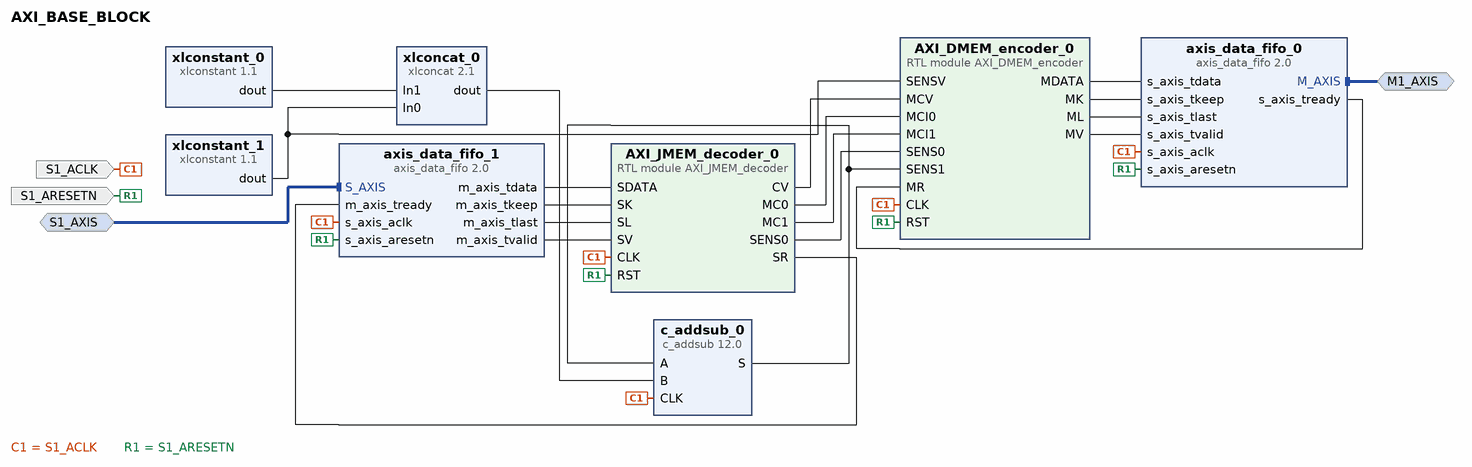
[diagram p0: block diagram of the top level]
# Vivado block design AXI_BASE_BLOCK, xc7z020clg400-1, Vivado 2024.1
create_bd_design AXI_BASE_BLOCK

create_bd_intf_port -mode Master -vlnv xilinx.com:interface:axis_rtl:1.0 M1_AXIS
create_bd_intf_port -mode Slave -vlnv xilinx.com:interface:axis_rtl:1.0 S1_AXIS
set_property -dict [list \
  CONFIG.HAS_TKEEP 1 \
  CONFIG.HAS_TLAST 1 \
  CONFIG.HAS_TREADY 1 \
  CONFIG.HAS_TSTRB 0 \
  CONFIG.LAYERED_METADATA undef \
  CONFIG.TDATA_NUM_BYTES 4 \
  CONFIG.TDEST_WIDTH 0 \
  CONFIG.TID_WIDTH 0 \
  CONFIG.TUSER_WIDTH 0 \
] [get_bd_intf_ports S1_AXIS]
create_bd_port -dir I -type clk S1_ACLK
set_property -dict [list \
  CONFIG.ASSOCIATED_BUSIF S1_AXIS:M1_AXIS \
  CONFIG.ASSOCIATED_RESET S1_ARESETN \
  CONFIG.FREQ_HZ 100000000 \
] [get_bd_ports S1_ACLK]
create_bd_port -dir I -type rst S1_ARESETN

create_bd_cell -type ip -vlnv xilinx.com:ip:axis_data_fifo:2.0 axis_data_fifo_1
set_property -dict [list \
  CONFIG.FIFO_DEPTH 16 \
  CONFIG.HAS_TKEEP 1 \
  CONFIG.HAS_TLAST 1 \
  CONFIG.TDATA_NUM_BYTES 4 \
] [get_bd_cells axis_data_fifo_1]
create_bd_cell -type ip -vlnv xilinx.com:ip:c_addsub:12.0 c_addsub_0
set_property -dict [list \
  CONFIG.A_Width 32 \
  CONFIG.B_Value 00000000000000000000000000000000 \
  CONFIG.B_Width 32 \
  CONFIG.CE false \
  CONFIG.Latency 1 \
  CONFIG.Out_Width 32 \
] [get_bd_cells c_addsub_0]
create_bd_cell -type ip -vlnv xilinx.com:ip:xlconcat:2.1 xlconcat_0
set_property -dict {CONFIG.IN1_WIDTH 31 CONFIG.NUM_PORTS 2} [get_bd_cells xlconcat_0]
create_bd_cell -type ip -vlnv xilinx.com:ip:xlconstant:1.1 xlconstant_0
set_property -dict {CONFIG.CONST_VAL 0 CONFIG.CONST_WIDTH 31} [get_bd_cells xlconstant_0]
create_bd_cell -type module -reference AXI_DMEM_encoder AXI_DMEM_encoder_0
create_bd_cell -type module -reference AXI_JMEM_decoder AXI_JMEM_decoder_0
create_bd_cell -type ip -vlnv xilinx.com:ip:xlconstant:1.1 xlconstant_1
create_bd_cell -type ip -vlnv xilinx.com:ip:axis_data_fifo:2.0 axis_data_fifo_0
set_property -dict [list \
  CONFIG.FIFO_DEPTH 16 \
  CONFIG.FIFO_MODE 1 \
  CONFIG.HAS_AEMPTY 0 \
  CONFIG.HAS_PROG_EMPTY 0 \
  CONFIG.HAS_PROG_FULL 0 \
  CONFIG.HAS_RD_DATA_COUNT 0 \
  CONFIG.HAS_TKEEP 1 \
  CONFIG.HAS_TLAST 1 \
  CONFIG.TDATA_NUM_BYTES 4 \
] [get_bd_cells axis_data_fifo_0]

# ---- connections ----

connect_bd_intf_net [get_bd_intf_ports S1_AXIS] [get_bd_intf_pins axis_data_fifo_1/S_AXIS]
connect_bd_intf_net [get_bd_intf_ports M1_AXIS] [get_bd_intf_pins axis_data_fifo_0/M_AXIS]
connect_bd_net [get_bd_pins AXI_DMEM_encoder_0/MDATA] [get_bd_pins axis_data_fifo_0/s_axis_tdata]
connect_bd_net [get_bd_pins AXI_DMEM_encoder_0/MK] [get_bd_pins axis_data_fifo_0/s_axis_tkeep]
connect_bd_net [get_bd_pins AXI_DMEM_encoder_0/ML] [get_bd_pins axis_data_fifo_0/s_axis_tlast]
connect_bd_net [get_bd_pins AXI_DMEM_encoder_0/MV] [get_bd_pins axis_data_fifo_0/s_axis_tvalid]
connect_bd_net [get_bd_pins AXI_JMEM_decoder_0/CV] [get_bd_pins AXI_DMEM_encoder_0/MCV]
connect_bd_net [get_bd_pins AXI_JMEM_decoder_0/MC0] [get_bd_pins AXI_DMEM_encoder_0/MCI0]
connect_bd_net [get_bd_pins AXI_JMEM_decoder_0/MC1] [get_bd_pins AXI_DMEM_encoder_0/MCI1]
connect_bd_net [get_bd_pins AXI_JMEM_decoder_0/SENS0] [get_bd_pins AXI_DMEM_encoder_0/SENS0]
connect_bd_net [get_bd_pins AXI_JMEM_decoder_0/SR] [get_bd_pins axis_data_fifo_1/m_axis_tready]
connect_bd_net -net CLK_IN_1 [get_bd_ports S1_ACLK] \
  [get_bd_pins axis_data_fifo_1/s_axis_aclk] [get_bd_pins c_addsub_0/CLK] [get_bd_pins AXI_JMEM_decoder_0/CLK] \
  [get_bd_pins axis_data_fifo_0/s_axis_aclk] [get_bd_pins AXI_DMEM_encoder_0/CLK]
connect_bd_net -net RST_IN_1 [get_bd_ports S1_ARESETN] \
  [get_bd_pins axis_data_fifo_1/s_axis_aresetn] [get_bd_pins AXI_JMEM_decoder_0/RST] \
  [get_bd_pins axis_data_fifo_0/s_axis_aresetn] [get_bd_pins AXI_DMEM_encoder_0/RST]
connect_bd_net [get_bd_pins axis_data_fifo_0/s_axis_tready] [get_bd_pins AXI_DMEM_encoder_0/MR]
connect_bd_net [get_bd_pins axis_data_fifo_1/m_axis_tdata] [get_bd_pins AXI_JMEM_decoder_0/SDATA]
connect_bd_net [get_bd_pins axis_data_fifo_1/m_axis_tkeep] [get_bd_pins AXI_JMEM_decoder_0/SK]
connect_bd_net [get_bd_pins axis_data_fifo_1/m_axis_tlast] [get_bd_pins AXI_JMEM_decoder_0/SL]
connect_bd_net [get_bd_pins axis_data_fifo_1/m_axis_tvalid] [get_bd_pins AXI_JMEM_decoder_0/SV]
connect_bd_net [get_bd_pins c_addsub_0/S] [get_bd_pins c_addsub_0/A] [get_bd_pins AXI_DMEM_encoder_0/SENS1]
connect_bd_net [get_bd_pins xlconcat_0/dout] [get_bd_pins c_addsub_0/B]
connect_bd_net [get_bd_pins xlconstant_0/dout] [get_bd_pins xlconcat_0/In1]
connect_bd_net [get_bd_pins xlconstant_1/dout] [get_bd_pins xlconcat_0/In0] [get_bd_pins AXI_DMEM_encoder_0/SENSV]

validate_bd_design
save_bd_design
